# Altium schematic sheet Power Management & Battery Monitor.SchDoc
size 431 x 279 mm; SheetNumber: 1; SheetTotal: 2; ENG_APP_DATE: --/--/--; DSN_APP_DATE: --/--/--; CHK_APP_DATE: --/--/--
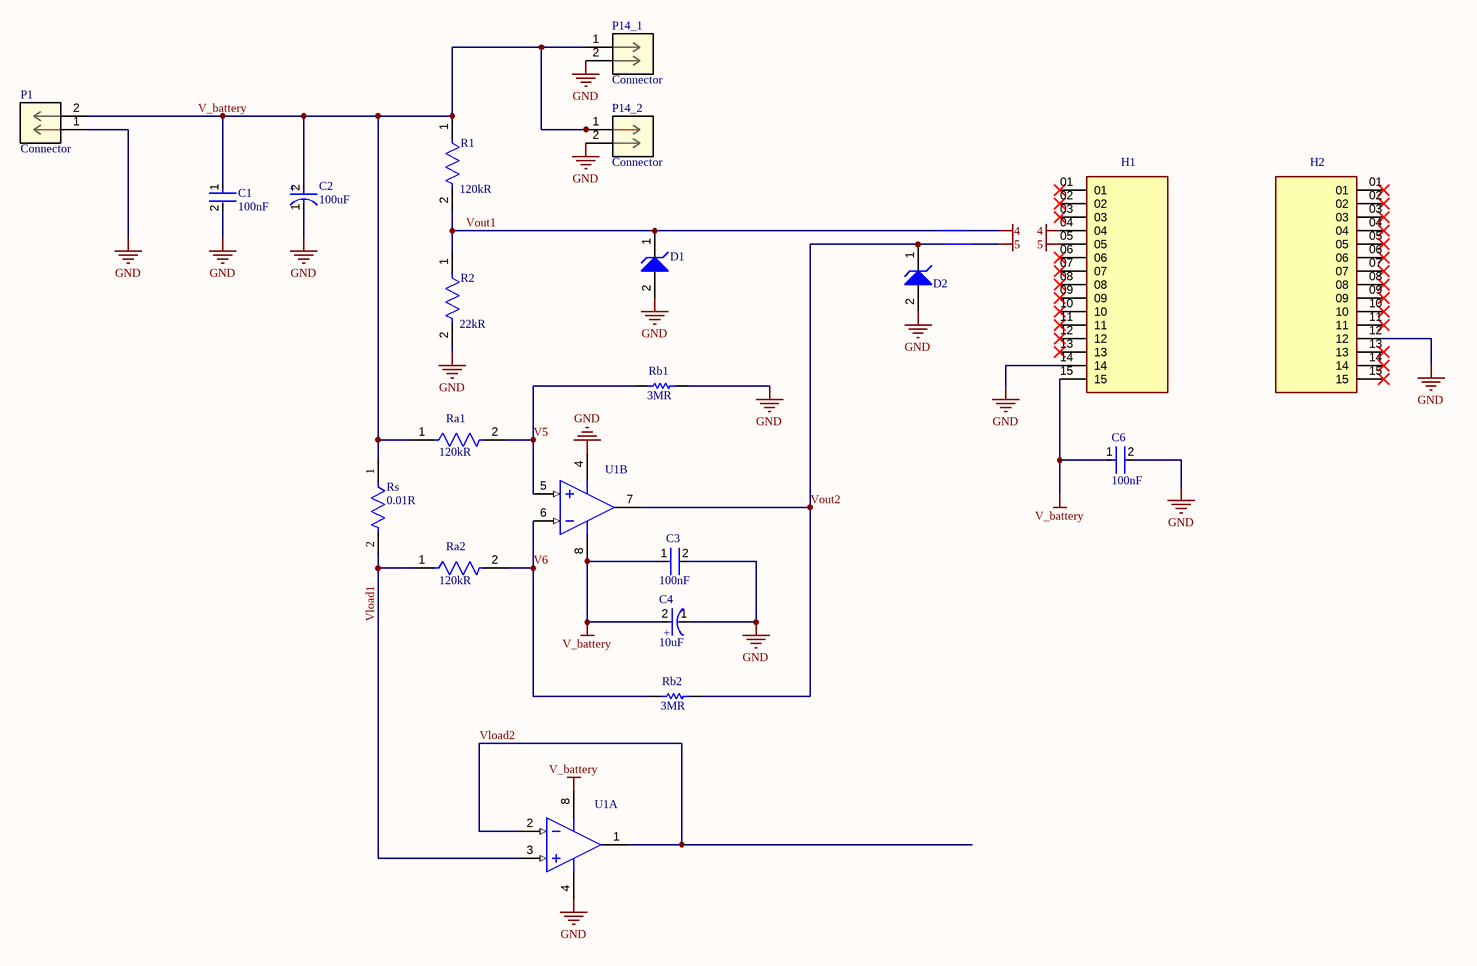
[diagram p0: Power Management & Battery Monitor.SchDoc]

## Parts
C1  value 100nF  [FP-CC0805-0_85-IPC_A]  (hidden comment: CC0805KRX7R8BB104)
C2  value 100uF  [FP-RAD-TH-D_6_3_0_5-L_11-MFG]  (hidden comment: EEU-FR1E101B)
C3  value 100nF  [FP-CC0805-0_85-IPC_A]  (hidden comment: CC0805KRX7R8BB104)
C4  value 10uF  [FP-FKB-MFG]  (hidden comment: EEE-FK1E100R)
C6  value 100nF  [FP-CC0805-0_85-IPC_A]  (hidden comment: CC0805KRX7R8BB104)
D1  1SMA5918BT3G  [ONSC-SMA-2-403D-02_F_V]  (value not drawn)
D2  1SMA5918BT3G  [ONSC-SMA-2-403D-02_F_V]  (value not drawn)
H1  PPTC151LFBN-RC  [SAMTEC_DW-15-12-G-S-807]  (value not drawn)
H2  PPTC151LFBN-RC  [SAMTEC_DW-15-12-G-S-807]  (value not drawn)
NT2  NetTie_SMD  [NetTie_SMD]  (value not drawn)  (net tie, no BOM)
NT3  NetTie_SMD  [NetTie_SMD]  (value not drawn)  (net tie, no BOM)
P1  Connector  [CONN_B2B-XH-A_JST]
P14_1  Connector  [CONN_B2B-XH-A_JST]
P14_2  Connector  [CONN_B2B-XH-A_JST]
R1  value 120kR  [FP-RG2012-IPC_A]  (hidden comment: RG2012P-124-B-T5)
R2  value 22kR  [FP-RC0805-0_6-MFG]  (hidden comment: RC0805FR-0722KL)
Ra1  value 120kR  [FP-RG2012-IPC_A]  (hidden comment: RG2012P-124-B-T5)
Ra2  value 120kR  [FP-RG2012-IPC_A]  (hidden comment: RG2012P-124-B-T5)
Rb1  value 3MR  [RESC3216X60X45NL10T20]  (hidden comment: CRCW12063M00FKEA)
Rb2  value 3MR  [RESC3216X60X45NL10T20]  (hidden comment: CRCW12063M00FKEA)
Rs  value 0.01R  [FP-FCSL110-0R002-0R100-IPC_C]  (hidden comment: FCSL110R010FER)
U1  OPA2192IDR  [D0008A_L]  (value not drawn)  (parts A,B of 2)

## Nets
4: H1.04 NT2.2
5: H1.05 NT3.2
GND: C1.2 C2.1(C) C3.2 C4.1(C) C6.2 D1.2(A) D2.2(A) H1.14 H2.12 P1.1 P14_1.2 P14_2.2 R2.2 Rb1.2 U1.4(V-)
V_battery: C1.1 C2.2(A) C3.1 C4.2(A) C6.1 H1.15 P1.2 P14_1.1 P14_2.1 R1.1 Ra1.1 Rs.1 U1.8(V+)
V5: Ra1.2 Rb1.1 U1.5(IN_B+)
V6: Ra2.2 Rb2.1 U1.6(IN_B-)
Vload1: Ra2.1 Rs.2 U1.3(IN_A+)
Vload2: U1.1(OUT_A) U1.2(IN_A-)
Vout1: D1.1(K) NT2.1 R1.2 R2.1
Vout2: D2.1(K) NT3.1 Rb2.2 U1.7(OUT_B)

Not connected (* = marked no-connect by the designer): H1 01* 02* 03* 06* 07* 08* 09* 10* 11* 12* 13*; H2 01* 02* 03* 04* 05* 06* 07* 08* 09* 10* 11* 13* 14* 15*

## Notes on the sheet
- DWG. NO.
- REV.
- SHT.
- THIS DOCUMENT AND THE DATA DISCLOSED HEREIN OR HEREWITH IS THE PROPERTY OF ALTIUM LIMITED AND MAY BE FREELY DISTRIBUTED IN WHOLE. NO RIGHTS ARE RESERVED OR EXPRESS OR IMPLIED WARANTEE GIVEN.
- REVISION
- DESCRIPTION
- DATE
- APPROVED
- ENG:
- APPROVALS
- PROJECT
- DSN:
- CHK:
- REFERENCE DOCUMENTS
- PROJECT REVISION:
- TITLE
- DOCUMENT REVISION:
- DESIGN ITEM:
- BOM:
- FAB DWG:
- PCB DWG:
- ASSY DWG:
- SCALE:
- SIZE
- B
- CAGE CODE
- FILE NAME
- DWG NO.
- SHEET
- OF
- REV
- (in symbol CMP-00014-1) +
- (in symbol CMP-00015-1) +

## Library data of the parts
C1 C3 C6 = CMP-00013-1: Ceramic Capacitor, Multilayer, Ceramic, 25V, 10% +Tol, 10% -Tol, X7R, 15% TC, 0.1uF, Surface Mount, 0805; Multilayer: Yes; Package Style: SMTMeter; Reach SVHC Compliant: Yes; Terminal Finish: Nickel; Tolerance  (fill in as +-): 10%; Dielectric Material: Ceramic; Termination: Wraparound; Min Operating Temperature: -55°C; Length: 2mm; Case/Package: 0805; Mounting Technology: Surface Mount; Temperature Characteristics Code: X7R; Packaging: Tape and Reel; Package Shape: Rectangular; Height: 0.85mm; Max Operating Temperature: 125°C; Rated DC Voltage (URdc): 25V; Pins: 2; RoHS Compliant: Yes; Width: 1.25mm; JESD-609 Code: e3; Capacitor Type: Ceramic; Tolerance (fill in as +-): 10%
C2 = CMP-00015-1: Aluminum Electrolytic Capacitor, Polarized, Aluminum (wet), 25V, 20% +Tol, 20% -Tol, 100uF, Through Hole Mount; Manufacturer Series: FR; Ripple Current: 318.5mA; Dielectric Material: Aluminium; Leakage Current: 25uA; Tan Delta: 0.14; JESD-609 Code: e3; Series: EEU-FR; Termination: Wire; Tolerance  (fill in as +-): 20%; RoHS Compliant: Yes; Terminal Pitch: 5mm; Package Style: RadialMeter; Reach SVHC Compliant: Yes; Diameter: 6.3mm; Length: 11.2mm; Polarity: Polarized; Min Operating Temperature: -40°C; Rated DC Voltage (URdc): 25V; Capacitor Type: Aluminium; Tolerance (fill in as +-): 20%; Mounting Technology: Through Hole; Terminal Finish: Tin; Pins: 2; Max Operating Temperature: 105°C; Packaging: Tape and Reel; Package Shape: Cylindrical
C4 = CMP-00014-1: Aluminum Electrolytic Capacitor, Polarized, Aluminum (wet), 25V, 20% +Tol, 20% -Tol, 10uF, Surface Mount, 1717; Capacitor Type: Aluminium; Reference Standard: AEC-Q200; Leakage Current: 2.5uA; Ripple Current: 67.5mA; Tan Delta: 0.14; Rated DC Voltage (URdc): 25V; Min Operating Temperature: -55°C; Case/Package: 1717; Tolerance  (fill in as +-): 20%; Termination: Flat; Tolerance (fill in as +-): 20%; RoHS Compliant: Yes; Mounting Technology: Surface Mount; Dielectric Material: Aluminium; Pins: 2; Height: 5.8mm; Polarity: Polarized; Length: 5.5mm; Packaging: Tape and Reel; Max Operating Temperature: 105°C; Reach SVHC Compliant: Yes; Package Style: SMTMeter; Width: 4.3mm
D1 D2 = CMP-00018-1: Zener Diode, 5.1V V(Z), 5%, 0.5W, Silicon, Unidirectional; Dynamic Impedance-Max: 4R; Max Power Dissipation: 500mW; Number of Elements: 1; Qualification Status: Not Qualified; Package Body Material: Plastic; Test Current: 73.5mA; Time @ Peak Reflow Temperature-Max (s): 40s; Terminal Finish: Tin; Surface Mount: Yes; Moisture Sensitivity Level: 1; Peak Reflow Temperature (Cel): 260°C; Diode Type: ZENER; Technology: ZENER; Voltage Tol-Max: 5%; Reach SVHC Compliant: No; Reference Voltage-Nom: 5.1V; Pins: 2; Terminal Position: DUAL; JESD-30 Code: R-PDSO-C2; Package Shape: Rectangular; Package Style: SMALL OUTLINEMeter; Polarity: Unidirectional; Min Operating Temperature: -65°C; Max Operating Temperature: 150°C; JESD-609 Code: e3; RoHS Compliant: Yes; Terminal Form: C BEND; Diode Element Material: SILICON
H1 H2 = PPTC151LFBN-RC: Board Connector, 15 Contact(s), 1 Row(s), Female, Straight, 0.1 inch Pitch, Solder Terminal, Locking; Manufacturer: Sullins; Manufacturer Series: PP; Contact Pattern: RECTANGULAR; Contact Style: SQ PIN-SKT; Number Of Connectors: 1; Rated Current (Signal): 3A; Number of Contacts: 15; Polarization Key: POLARIZED HOUSING; Body Breadth: 0.094inch; Body Depth: 0.334inch; Body Length: 1.52inch; Reference Standard: UL; Reliability: COMMERCIAL; Supplier: Digikey; Supplier Part Number: S7013-ND; Manufacturer Part Number: PPTC151LFBN-RC; RoHS: Yes; Category: Headers and Wire Housings; Stock: 14275; Pricing: 1=0.99, 10=0.836, 80=0.75075, 440=0.61425, 1000=0.546, 5000=0.4875 (USD); Mounting Technology: Board; Contact Material: Bronze; Contact Finish - Mating: SN; Contact Finish - Termination: TIN; Insulation Material: Polyester; Connector Type: BOARD CONNECTOR; Contact Gender: Female; Mounting Style: STRAIGHT; Number Of PCB Rows: 1; Number of Rows Loaded: 1; Termination: Solder; PCB Contact Pattern: RECTANGULAR; Mating Contact Pitch: 0.1inch; Terminal Length: 0.125inch; Terminal Pitch: 2.54mm; Mounting Option 1: LOCKING; Reach SVHC Compliant: Yes; RoHS Compliant: Yes; ComponentLink1URL: https://datasheet.ciiva.com:443/pdfs/VipMasterIC/IC/SUCS/SUCSS00270/SUCSS00270-1.pdf?src-supplier=IHS+Markit; ComponentLink1Description: https://datasheet.ciiva.com:443/pdfs/VipMasterIC/IC/SUCS/SUCSS00270/SUCSS00270-1.pdf?src-supplier=IHS+Markit; ComponentLink2URL: https://media.digikey.com/pdf/Data%20Sheets/Sullins%20PDFs/Female_Headers.100_DS.pdf?src-supplier=Digikey; ComponentLink2Description: https://media.digikey.com/pdf/Data%20Sheets/Sullins%20PDFs/Female_Headers.100_DS.pdf?src-supplier=Digikey
NT2 NT3 = NetTie_SMD: Net Tie SMD
P1 P14_1 P14_2 = B2B-XH-A: Header B2B-XH-A, 2.50mm, 2-contacts, top entry, THT /1000/box; Manufacturer: JST; Supplier: Digikey; Supplier Part Number: 455-B2B-XH-A-ND; Manufacturer Part Number: B2B-XH-A; RoHS: Yes; Category: FFC / FPC; Stock: 990478; Pricing: 1=0.15, 10=0.122, 100=0.0898, 500=0.07432, 1000=0.06502, 5000=0.05573, 10000=0.05419 (USD); ComponentLink1URL: https://www.distrelec.biz/Web/Downloads/_t/ds/xh-series_eng_tds.pdf?mime=application%2Fpdf&src-supplier=Distrelec; ComponentLink1Description: https://www.distrelec.biz/Web/Downloads/_t/ds/xh-series_eng_tds.pdf?mime=application%2Fpdf&src-supplier=Distrelec
R1 Ra1 Ra2 = CMP-00008-1: Fixed Resistor, Thin Film, 0.125W, 120000ohm, 150V, 0.1% +/-Tol, 25ppm/Cel, Surface Mount, 0805; Temperature Coefficient (ppm/Cel): 25; Package Height: 0.4mm; Package Length: 2mm; Package Width: 1.25mm; Additional Feature: ANTI-SULFUR, PRECISION; Rated Temperature: 70°C; Power: 250mW; Reference Standard: AEC-Q200; Termination: Wraparound; Construction: Rectangular; Tolerance: 0.1%; Working Voltage: 150V; Resistor Type: FIXED RESISTOR; Packaging: Tape and Reel; Min Operating Temperature: -55°C; Reach SVHC Compliant: Yes; Pins: 2; JESD-609 Code: e3; RoHS Compliant: Yes; Case/Package: 0805; Mounting Technology: Surface Mount; Terminal Finish: Nickel; Max Operating Temperature: 155°C; Technology: THIN FILM
R2 = CMP-00010-1: Fixed Resistor, Metal Glaze/thick Film, 0.125W, 22000ohm, 150V, 1% +/-Tol, 100ppm/Cel, Surface Mount, 0805; Power: 125mW; Additional Feature: LASER TRIMMABLE; Rated Temperature: 70°C; Package Height: 0.5mm; Package Length: 2mm; Temperature Coefficient (ppm/Cel): 100; Package Width: 1.25mm; Tolerance: 1%; Package Shape: Rectangular; Mounting Technology: Surface Mount; Construction: Chip; Packaging: Tape and Reel; Working Voltage: 150V; Resistor Type: FIXED RESISTOR; Reach SVHC Compliant: Yes; JESD-609 Code: e3; Termination: Wraparound; Max Operating Temperature: 155°C; Pins: 2; Terminal Finish: Nickel; Min Operating Temperature: -55°C; RoHS Compliant: Yes; Case/Package: 0805; Technology: METAL GLAZE/THICK FILM
Rb1 Rb2 = CMP-00011-1: Fixed Resistor, Metal Glaze/thick Film, 0.25W, 3000000ohm, 200V, 1% +/-Tol, 100ppm/Cel, Surface Mount, 1206; Power: 250mW; Temperature Coefficient (ppm/Cel): 100; Rated Temperature: 70°C; Package Height: 0.55mm; Package Length: 3.2mm; Package Width: 1.6mm; Reference Standard: AEC-Q200; Additional Feature: RATED AC VOLTAGE (V): 200; Pins: 2; Case/Package: 1206; JESD-609 Code: e3; RoHS Compliant: Yes; Termination: Wraparound; Max Operating Temperature: 155°C; Technology: METAL GLAZE/THICK FILM; Min Operating Temperature: -55°C; Mounting Technology: Surface Mount; Packaging: Tape and Reel; Working Voltage: 200V; Package Shape: Rectangular; Tolerance: 1%; Reach SVHC Compliant: Yes; Construction: Chip; Terminal Finish: Nickel; Resistor Type: FIXED RESISTOR
Rs = CMP-00017-1: Fixed Resistor, Metal Foil, 5W, 0.01ohm, 1% +/-Tol, 50ppm/Cel, Surface Mount, 4320; Package Length: 11mm; Temperature Coefficient (ppm/Cel): 50; Package Width: 5mm; Rated Temperature: 70°C; Package Height: 0.5mm; RoHS Compliant: Yes; Case/Package: 4320; Technology: METAL FOIL; Tolerance: 1%; Resistor Type: FIXED RESISTOR; Termination: Wraparound; Pins: 2; Min Operating Temperature: -55°C; Reach SVHC Compliant: Yes; Power: 5W; Max Operating Temperature: 155°C; Mounting Technology: Surface Mount; Packaging: Tape and Reel; Construction: Rectangular
U1 = CMP-00016-1: Operational Amplifier, 2 Func, 25uV Offset-Max, BIPolar, PDSO8; Channels: 2; Architecture: VOLTAGE-FEEDBACK; Bias Current-Max (IIB) @25C: 20pA; Package Body Material: Plastic; Frequency Compensation: YES; Qualification Status: Not Qualified; Input Offset Voltage-Max: 75uV; Max Supply Current: 3mA; Voltage Gain-Min: 100000; Neg Supply Voltage Limit-Max: -20V; Package Equivalence Code: SOP8,.25; Supply Voltage Limit-Max: 20V; Power Supplies: +-2.25/+-18/4.5/36V; Max Operating Temperature: 125°C; Moisture Sensitivity Level: 2; Height - Seated (Max): 1.75mm; Temperature Grade: AUTOMOTIVE; RoHS Compliant: Yes; Terminal Form: Gull Wing; Package Style: SMALL OUTLINEMeter; Terminal Finish: Nickel; Terminal Position: DUAL; Width: 3.91mm; Min Operating Temperature: -40°C; Length: 4.9mm; Peak Reflow Temperature (Cel): 260°C; Terminal Pitch: 1.27mm; JESD-30 Code: R-PDSO-G8; Technology: BIPOLAR; Low-Bias: Yes; Surface Mount: Yes; Amplifier Type: OPERATIONAL AMPLIFIER; Reach SVHC Compliant: Yes; Low-Offset: Yes; Pins: 8; JESD-609 Code: e4; Package Shape: Rectangular; Case/Package: SOP